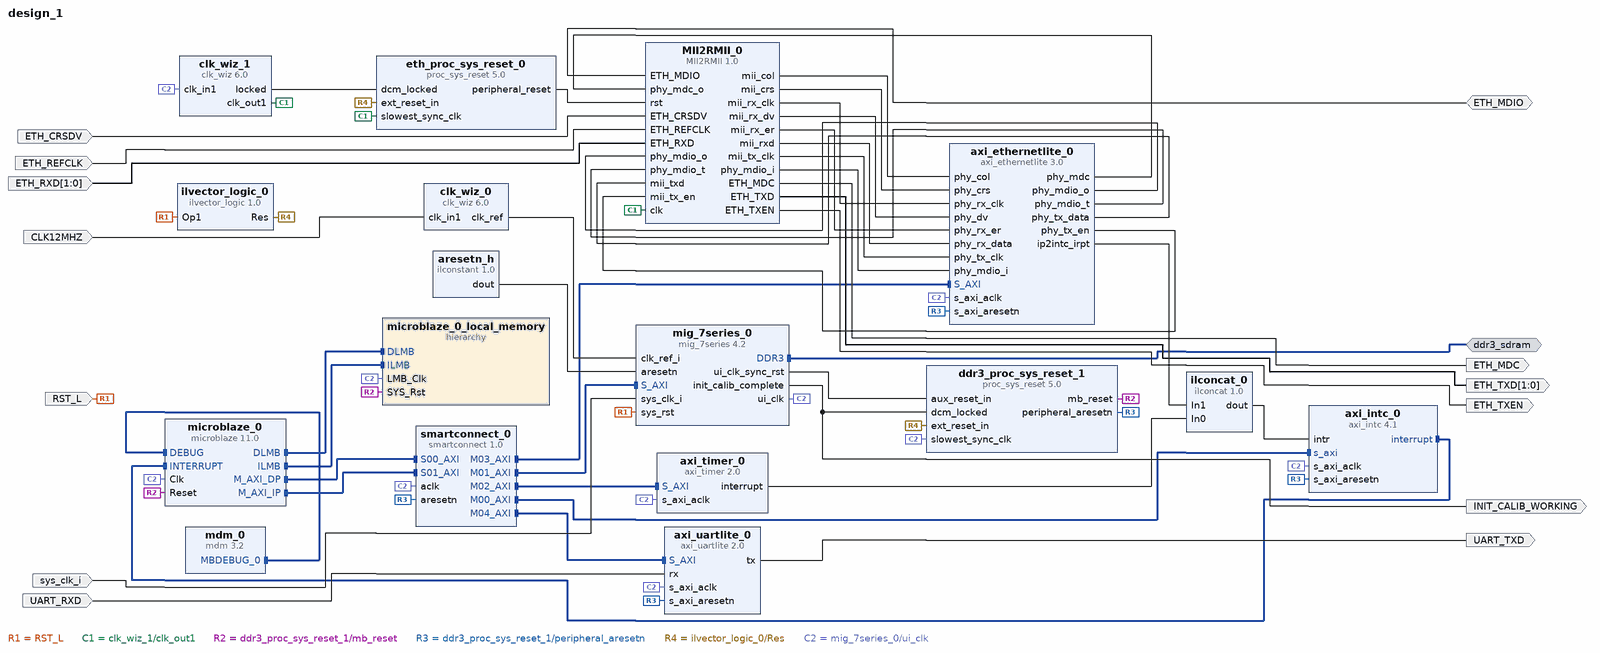
[diagram p0: block diagram of the top level]
# Vivado block design design_1, xc7s25csga324-1, Vivado 2025.2
create_bd_design design_1

create_bd_intf_port -mode Master -vlnv xilinx.com:interface:ddrx_rtl:1.0 ddr3_sdram
create_bd_port -dir I -type rst RST_L
set_property -dict {CONFIG.POLARITY ACTIVE_LOW} [get_bd_ports RST_L]
create_bd_port -dir I -type clk sys_clk_i
create_bd_port -dir O -type data INIT_CALIB_WORKING
create_bd_port -dir O -from 1 -to 0 ETH_TXD
create_bd_port -dir O ETH_TXEN
create_bd_port -dir I ETH_REFCLK
create_bd_port -dir I ETH_CRSDV
create_bd_port -dir I -from 1 -to 0 ETH_RXD
create_bd_port -dir I -type clk CLK12MHZ
set_property -dict {CONFIG.FREQ_HZ 12000000} [get_bd_ports CLK12MHZ]
create_bd_port -dir I UART_RXD
create_bd_port -dir O UART_TXD
create_bd_port -dir O ETH_MDC
create_bd_port -dir IO ETH_MDIO

create_bd_cell -type ip -vlnv xilinx.com:ip:microblaze:11.0 microblaze_0
set_property -dict [list \
  CONFIG.C_DATA_SIZE 32 \
  CONFIG.C_DEBUG_ENABLED 1 \
  CONFIG.C_D_AXI 1 \
  CONFIG.C_D_LMB 1 \
  CONFIG.C_ENABLE_CONVERSION 0 \
  CONFIG.C_I_AXI 1 \
  CONFIG.C_I_LMB 1 \
  CONFIG.C_M_AXI_DP_DATA_WIDTH 32 \
  CONFIG.C_USE_MSR_INSTR 1 \
] [get_bd_cells microblaze_0]
create_bd_cell -type ip -vlnv xilinx.com:ip:axi_intc:4.1 axi_intc_0
create_bd_cell -type ip -vlnv xilinx.com:ip:mdm:3.2 mdm_0
set_property -dict {CONFIG.C_USE_UART 0} [get_bd_cells mdm_0]
create_bd_cell -type hier microblaze_0_local_memory
create_bd_cell -type ip -vlnv xilinx.com:ip:smartconnect:1.0 smartconnect_0
set_property -dict {CONFIG.NUM_MI 5} [get_bd_cells smartconnect_0]
create_bd_cell -type ip -vlnv xilinx.com:ip:mig_7series:4.2 mig_7series_0
set_property -dict [list \
  CONFIG.BOARD_MIG_PARAM ddr3_sdram \
  CONFIG.MIG_DONT_TOUCH_PARAM Custom \
  CONFIG.RESET_BOARD_INTERFACE Custom \
  CONFIG.XML_INPUT_FILE board.prj \
] [get_bd_cells mig_7series_0]
create_bd_cell -type ip -vlnv xilinx.com:ip:proc_sys_reset:5.0 ddr3_proc_sys_reset_1
create_bd_cell -type ip -vlnv xilinx.com:ip:clk_wiz:6.0 clk_wiz_0
set_property -dict [list \
  CONFIG.CLKIN1_JITTER_PS 833.33 \
  CONFIG.CLKOUT1_JITTER 441.867 \
  CONFIG.CLKOUT1_PHASE_ERROR 668.310 \
  CONFIG.CLKOUT1_REQUESTED_OUT_FREQ 200.000 \
  CONFIG.CLKOUT2_JITTER 522.440 \
  CONFIG.CLKOUT2_PHASE_ERROR 613.025 \
  CONFIG.CLKOUT2_REQUESTED_OUT_FREQ 200.000 \
  CONFIG.CLKOUT2_USED false \
  CONFIG.CLK_OUT1_PORT clk_ref \
  CONFIG.CLK_OUT2_PORT clk_ref \
  CONFIG.MMCM_CLKFBOUT_MULT_F 62.500 \
  CONFIG.MMCM_CLKIN1_PERIOD 83.333 \
  CONFIG.MMCM_CLKIN2_PERIOD 10.0 \
  CONFIG.MMCM_CLKOUT0_DIVIDE_F 3.750 \
  CONFIG.MMCM_CLKOUT1_DIVIDE 1 \
  CONFIG.NUM_OUT_CLKS 1 \
  CONFIG.PRIM_IN_FREQ 12 \
  CONFIG.USE_LOCKED false \
  CONFIG.USE_RESET false \
] [get_bd_cells clk_wiz_0]
create_bd_cell -type ip -vlnv xilinx.com:ip:axi_timer:2.0 axi_timer_0
create_bd_cell -type inline_hdl -vlnv xilinx.com:inline_hdl:ilconcat:1.0 ilconcat_0
create_bd_cell -type ip -vlnv xilinx.com:ip:axi_ethernetlite:3.0 axi_ethernetlite_0
create_bd_cell -type ip -vlnv xilinx.com:user:MII2RMII:1.0 MII2RMII_0
create_bd_cell -type ip -vlnv xilinx.com:ip:proc_sys_reset:5.0 eth_proc_sys_reset_0
create_bd_cell -type ip -vlnv xilinx.com:ip:clk_wiz:6.0 clk_wiz_1
set_property -dict [list \
  CONFIG.CLKOUT1_JITTER 426.334 \
  CONFIG.CLKOUT1_REQUESTED_OUT_FREQ 50.000 \
  CONFIG.MMCM_CLKOUT0_DIVIDE_F 15.875 \
  CONFIG.USE_LOCKED true \
  CONFIG.USE_RESET false \
] [get_bd_cells clk_wiz_1]
create_bd_cell -type inline_hdl -vlnv xilinx.com:inline_hdl:ilvector_logic:1.0 ilvector_logic_0
set_property -dict {CONFIG.C_OPERATION not} [get_bd_cells ilvector_logic_0]
create_bd_cell -type inline_hdl -vlnv xilinx.com:inline_hdl:ilconstant:1.0 aresetn_h
create_bd_cell -type ip -vlnv xilinx.com:ip:axi_uartlite:2.0 axi_uartlite_0
set_property -dict {CONFIG.C_BAUDRATE 115200 CONFIG.UARTLITE_BOARD_INTERFACE usb_uart} [get_bd_cells axi_uartlite_0]

# ---- hierarchy /microblaze_0_local_memory ----
current_bd_instance /microblaze_0_local_memory
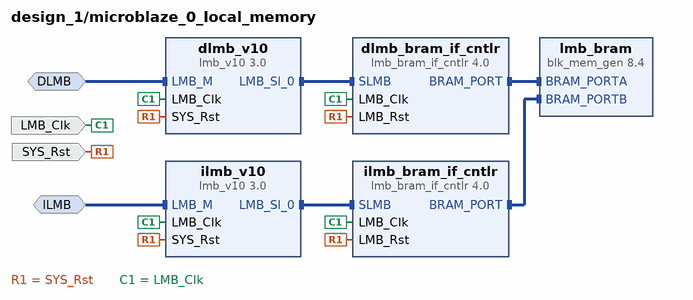
[diagram p1: block diagram inside /microblaze_0_local_memory]
create_bd_intf_pin -mode MirroredMaster -vlnv xilinx.com:interface:lmb_rtl:1.0 DLMB
create_bd_intf_pin -mode MirroredMaster -vlnv xilinx.com:interface:lmb_rtl:1.0 ILMB
create_bd_pin -dir I -type clk LMB_Clk
create_bd_pin -dir I -type rst SYS_Rst

create_bd_cell -type ip -vlnv xilinx.com:ip:lmb_v10:3.0 dlmb_v10
create_bd_cell -type ip -vlnv xilinx.com:ip:lmb_v10:3.0 ilmb_v10
create_bd_cell -type ip -vlnv xilinx.com:ip:lmb_bram_if_cntlr:4.0 dlmb_bram_if_cntlr
set_property -dict {CONFIG.C_ECC 0} [get_bd_cells dlmb_bram_if_cntlr]
create_bd_cell -type ip -vlnv xilinx.com:ip:lmb_bram_if_cntlr:4.0 ilmb_bram_if_cntlr
set_property -dict {CONFIG.C_ECC 0} [get_bd_cells ilmb_bram_if_cntlr]
create_bd_cell -type ip -vlnv xilinx.com:ip:blk_mem_gen:8.4 lmb_bram
set_property -dict {CONFIG.Memory_Type True_Dual_Port_RAM CONFIG.use_bram_block BRAM_Controller} [get_bd_cells lmb_bram]

# ---- connections ----

current_bd_instance /microblaze_0_local_memory
connect_bd_intf_net -intf_net microblaze_0_dlmb [get_bd_intf_pins dlmb_v10/LMB_M] [get_bd_intf_pins DLMB]
connect_bd_intf_net -intf_net microblaze_0_dlmb_bus [get_bd_intf_pins dlmb_v10/LMB_Sl_0] [get_bd_intf_pins dlmb_bram_if_cntlr/SLMB]
connect_bd_intf_net -intf_net microblaze_0_dlmb_cntlr [get_bd_intf_pins dlmb_bram_if_cntlr/BRAM_PORT] [get_bd_intf_pins lmb_bram/BRAM_PORTA]
connect_bd_intf_net -intf_net microblaze_0_ilmb [get_bd_intf_pins ilmb_v10/LMB_M] [get_bd_intf_pins ILMB]
connect_bd_intf_net -intf_net microblaze_0_ilmb_bus [get_bd_intf_pins ilmb_v10/LMB_Sl_0] [get_bd_intf_pins ilmb_bram_if_cntlr/SLMB]
connect_bd_intf_net -intf_net microblaze_0_ilmb_cntlr [get_bd_intf_pins ilmb_bram_if_cntlr/BRAM_PORT] [get_bd_intf_pins lmb_bram/BRAM_PORTB]
connect_bd_net [get_bd_pins SYS_Rst] \
  [get_bd_pins dlmb_v10/SYS_Rst] [get_bd_pins ilmb_v10/SYS_Rst] [get_bd_pins ilmb_bram_if_cntlr/LMB_Rst] \
  [get_bd_pins dlmb_bram_if_cntlr/LMB_Rst]
connect_bd_net -net microblaze_0_Clk [get_bd_pins LMB_Clk] \
  [get_bd_pins dlmb_v10/LMB_Clk] [get_bd_pins dlmb_bram_if_cntlr/LMB_Clk] [get_bd_pins ilmb_v10/LMB_Clk] \
  [get_bd_pins ilmb_bram_if_cntlr/LMB_Clk]
set_property HDL_ATTRIBUTE.BMM_INFO_ADDRESS_SPACE {byte  0x00000000 32 > design_1 microblaze_0_local_memory/lmb_bram} [get_bd_cells dlmb_bram_if_cntlr]
set_property HDL_ATTRIBUTE.KEEP_HIERARCHY yes [get_bd_cells dlmb_bram_if_cntlr]

current_bd_instance /
connect_bd_intf_net [get_bd_intf_pins axi_intc_0/interrupt] [get_bd_intf_pins microblaze_0/INTERRUPT]
connect_bd_intf_net [get_bd_intf_pins microblaze_0/M_AXI_DP] [get_bd_intf_pins smartconnect_0/S00_AXI]
connect_bd_intf_net [get_bd_intf_pins microblaze_0/M_AXI_IP] [get_bd_intf_pins smartconnect_0/S01_AXI]
connect_bd_intf_net [get_bd_intf_pins mdm_0/MBDEBUG_0] [get_bd_intf_pins microblaze_0/DEBUG]
connect_bd_intf_net [get_bd_intf_pins microblaze_0/DLMB] [get_bd_intf_pins microblaze_0_local_memory/DLMB]
connect_bd_intf_net [get_bd_intf_pins microblaze_0/ILMB] [get_bd_intf_pins microblaze_0_local_memory/ILMB]
connect_bd_intf_net [get_bd_intf_ports ddr3_sdram] [get_bd_intf_pins mig_7series_0/DDR3]
connect_bd_intf_net [get_bd_intf_pins axi_intc_0/s_axi] [get_bd_intf_pins smartconnect_0/M00_AXI]
connect_bd_intf_net [get_bd_intf_pins mig_7series_0/S_AXI] [get_bd_intf_pins smartconnect_0/M01_AXI]
connect_bd_intf_net [get_bd_intf_pins axi_timer_0/S_AXI] [get_bd_intf_pins smartconnect_0/M02_AXI]
connect_bd_intf_net [get_bd_intf_pins smartconnect_0/M03_AXI] [get_bd_intf_pins axi_ethernetlite_0/S_AXI]
connect_bd_intf_net [get_bd_intf_pins smartconnect_0/M04_AXI] [get_bd_intf_pins axi_uartlite_0/S_AXI]
connect_bd_net -net ETH_CRSDV_0_1 [get_bd_ports ETH_CRSDV] [get_bd_pins MII2RMII_0/ETH_CRSDV]
connect_bd_net -net ETH_REFCLK_0_1 [get_bd_ports ETH_REFCLK] [get_bd_pins MII2RMII_0/ETH_REFCLK]
connect_bd_net -net ETH_RXD_0_1 [get_bd_ports ETH_RXD] [get_bd_pins MII2RMII_0/ETH_RXD]
connect_bd_net [get_bd_pins MII2RMII_0/ETH_MDC] [get_bd_ports ETH_MDC]
connect_bd_net [get_bd_pins MII2RMII_0/ETH_TXD] [get_bd_ports ETH_TXD]
connect_bd_net [get_bd_pins MII2RMII_0/ETH_TXEN] [get_bd_ports ETH_TXEN]
connect_bd_net [get_bd_pins MII2RMII_0/mii_col] [get_bd_pins axi_ethernetlite_0/phy_col]
connect_bd_net [get_bd_pins MII2RMII_0/mii_crs] [get_bd_pins axi_ethernetlite_0/phy_crs]
connect_bd_net [get_bd_pins MII2RMII_0/mii_rx_clk] [get_bd_pins axi_ethernetlite_0/phy_rx_clk]
connect_bd_net [get_bd_pins MII2RMII_0/mii_rx_dv] [get_bd_pins axi_ethernetlite_0/phy_dv]
connect_bd_net [get_bd_pins MII2RMII_0/mii_rx_er] [get_bd_pins axi_ethernetlite_0/phy_rx_er]
connect_bd_net [get_bd_pins MII2RMII_0/mii_rxd] [get_bd_pins axi_ethernetlite_0/phy_rx_data]
connect_bd_net [get_bd_pins MII2RMII_0/mii_tx_clk] [get_bd_pins axi_ethernetlite_0/phy_tx_clk]
connect_bd_net [get_bd_pins MII2RMII_0/phy_mdio_i] [get_bd_pins axi_ethernetlite_0/phy_mdio_i]
connect_bd_net [get_bd_ports ETH_MDIO] [get_bd_pins MII2RMII_0/ETH_MDIO]
connect_bd_net [get_bd_ports RST_L] [get_bd_pins ilvector_logic_0/Op1] [get_bd_pins mig_7series_0/sys_rst]
connect_bd_net -net SYS_CLK_1 [get_bd_ports sys_clk_i] [get_bd_pins mig_7series_0/sys_clk_i]
connect_bd_net [get_bd_pins axi_ethernetlite_0/ip2intc_irpt] [get_bd_pins ilconcat_0/In1]
connect_bd_net [get_bd_pins axi_ethernetlite_0/phy_mdc] [get_bd_pins MII2RMII_0/phy_mdc_o]
connect_bd_net [get_bd_pins axi_ethernetlite_0/phy_mdio_o] [get_bd_pins MII2RMII_0/phy_mdio_o]
connect_bd_net [get_bd_pins axi_ethernetlite_0/phy_mdio_t] [get_bd_pins MII2RMII_0/phy_mdio_t]
connect_bd_net [get_bd_pins axi_ethernetlite_0/phy_tx_data] [get_bd_pins MII2RMII_0/mii_txd]
connect_bd_net [get_bd_pins axi_ethernetlite_0/phy_tx_en] [get_bd_pins MII2RMII_0/mii_tx_en]
connect_bd_net [get_bd_pins axi_timer_0/interrupt] [get_bd_pins ilconcat_0/In0]
connect_bd_net [get_bd_pins axi_uartlite_0/tx] [get_bd_ports UART_TXD]
connect_bd_net -net clk_in1_0_1 [get_bd_ports CLK12MHZ] [get_bd_pins clk_wiz_0/clk_in1]
connect_bd_net [get_bd_pins clk_wiz_0/clk_ref] [get_bd_pins mig_7series_0/clk_ref_i]
connect_bd_net [get_bd_pins clk_wiz_1/clk_out1] [get_bd_pins eth_proc_sys_reset_0/slowest_sync_clk] [get_bd_pins MII2RMII_0/clk]
connect_bd_net [get_bd_pins clk_wiz_1/locked] [get_bd_pins eth_proc_sys_reset_0/dcm_locked]
connect_bd_net [get_bd_pins ddr3_proc_sys_reset_1/mb_reset] [get_bd_pins microblaze_0/Reset] [get_bd_pins microblaze_0_local_memory/SYS_Rst]
connect_bd_net [get_bd_pins ddr3_proc_sys_reset_1/peripheral_aresetn] \
  [get_bd_pins axi_intc_0/s_axi_aresetn] [get_bd_pins axi_ethernetlite_0/s_axi_aresetn] [get_bd_pins smartconnect_0/aresetn] \
  [get_bd_pins axi_uartlite_0/s_axi_aresetn]
connect_bd_net [get_bd_pins eth_proc_sys_reset_0/peripheral_reset] [get_bd_pins MII2RMII_0/rst]
connect_bd_net [get_bd_pins ilconcat_0/dout] [get_bd_pins axi_intc_0/intr]
connect_bd_net -net ilconstant_0_dout [get_bd_pins aresetn_h/dout] [get_bd_pins mig_7series_0/aresetn]
connect_bd_net [get_bd_pins ilvector_logic_0/Res] [get_bd_pins eth_proc_sys_reset_0/ext_reset_in] [get_bd_pins ddr3_proc_sys_reset_1/ext_reset_in]
connect_bd_net [get_bd_pins mig_7series_0/init_calib_complete] [get_bd_pins ddr3_proc_sys_reset_1/dcm_locked] [get_bd_ports INIT_CALIB_WORKING]
connect_bd_net [get_bd_pins mig_7series_0/ui_clk] \
  [get_bd_pins ddr3_proc_sys_reset_1/slowest_sync_clk] [get_bd_pins microblaze_0/Clk] [get_bd_pins smartconnect_0/aclk] \
  [get_bd_pins microblaze_0_local_memory/LMB_Clk] [get_bd_pins axi_intc_0/s_axi_aclk] [get_bd_pins axi_timer_0/s_axi_aclk] \
  [get_bd_pins axi_ethernetlite_0/s_axi_aclk] [get_bd_pins clk_wiz_1/clk_in1] [get_bd_pins axi_uartlite_0/s_axi_aclk]
connect_bd_net [get_bd_pins mig_7series_0/ui_clk_sync_rst] [get_bd_pins ddr3_proc_sys_reset_1/aux_reset_in]
connect_bd_net -net rx_0_1 [get_bd_ports UART_RXD] [get_bd_pins axi_uartlite_0/rx]
set_property HDL_ATTRIBUTE.BMM_INFO_PROCESSOR {microblaze-le > design_1 microblaze_0_local_memory/dlmb_bram_if_cntlr} [get_bd_cells microblaze_0]
set_property HDL_ATTRIBUTE.KEEP_HIERARCHY yes [get_bd_cells microblaze_0]

# ---- address map ----
assign_bd_address -offset 0x00000000 -range 64K -target_address_space [get_bd_addr_spaces microblaze_0/Data] [get_bd_addr_segs microblaze_0_local_memory/dlmb_bram_if_cntlr/SLMB/Mem]
assign_bd_address -offset 0x40600000 -range 64K -target_address_space [get_bd_addr_spaces microblaze_0/Data] [get_bd_addr_segs axi_uartlite_0/S_AXI/Reg]
assign_bd_address -offset 0x40E00000 -range 64K -target_address_space [get_bd_addr_spaces microblaze_0/Data] [get_bd_addr_segs axi_ethernetlite_0/S_AXI/Reg]
assign_bd_address -offset 0x41200000 -range 64K -target_address_space [get_bd_addr_spaces microblaze_0/Data] [get_bd_addr_segs axi_intc_0/S_AXI/Reg]
assign_bd_address -offset 0x41C00000 -range 64K -target_address_space [get_bd_addr_spaces microblaze_0/Data] [get_bd_addr_segs axi_timer_0/S_AXI/Reg]
assign_bd_address -offset 0x80000000 -range 256M -target_address_space [get_bd_addr_spaces microblaze_0/Data] [get_bd_addr_segs mig_7series_0/memmap/memaddr]
assign_bd_address -offset 0x00000000 -range 64K -target_address_space [get_bd_addr_spaces microblaze_0/Instruction] [get_bd_addr_segs microblaze_0_local_memory/ilmb_bram_if_cntlr/SLMB/Mem]
assign_bd_address -offset 0x40600000 -range 64K -target_address_space [get_bd_addr_spaces microblaze_0/Instruction] [get_bd_addr_segs axi_uartlite_0/S_AXI/Reg]
assign_bd_address -offset 0x40E00000 -range 64K -target_address_space [get_bd_addr_spaces microblaze_0/Instruction] [get_bd_addr_segs axi_ethernetlite_0/S_AXI/Reg]
assign_bd_address -offset 0x41200000 -range 64K -target_address_space [get_bd_addr_spaces microblaze_0/Instruction] [get_bd_addr_segs axi_intc_0/S_AXI/Reg]
assign_bd_address -offset 0x41C00000 -range 64K -target_address_space [get_bd_addr_spaces microblaze_0/Instruction] [get_bd_addr_segs axi_timer_0/S_AXI/Reg]
assign_bd_address -offset 0x80000000 -range 256M -target_address_space [get_bd_addr_spaces microblaze_0/Instruction] [get_bd_addr_segs mig_7series_0/memmap/memaddr]

validate_bd_design
save_bd_design
